# Altium schematic sheet TopLevel.SchDoc
size A4; SheetNumber: 1; SheetTotal: 3
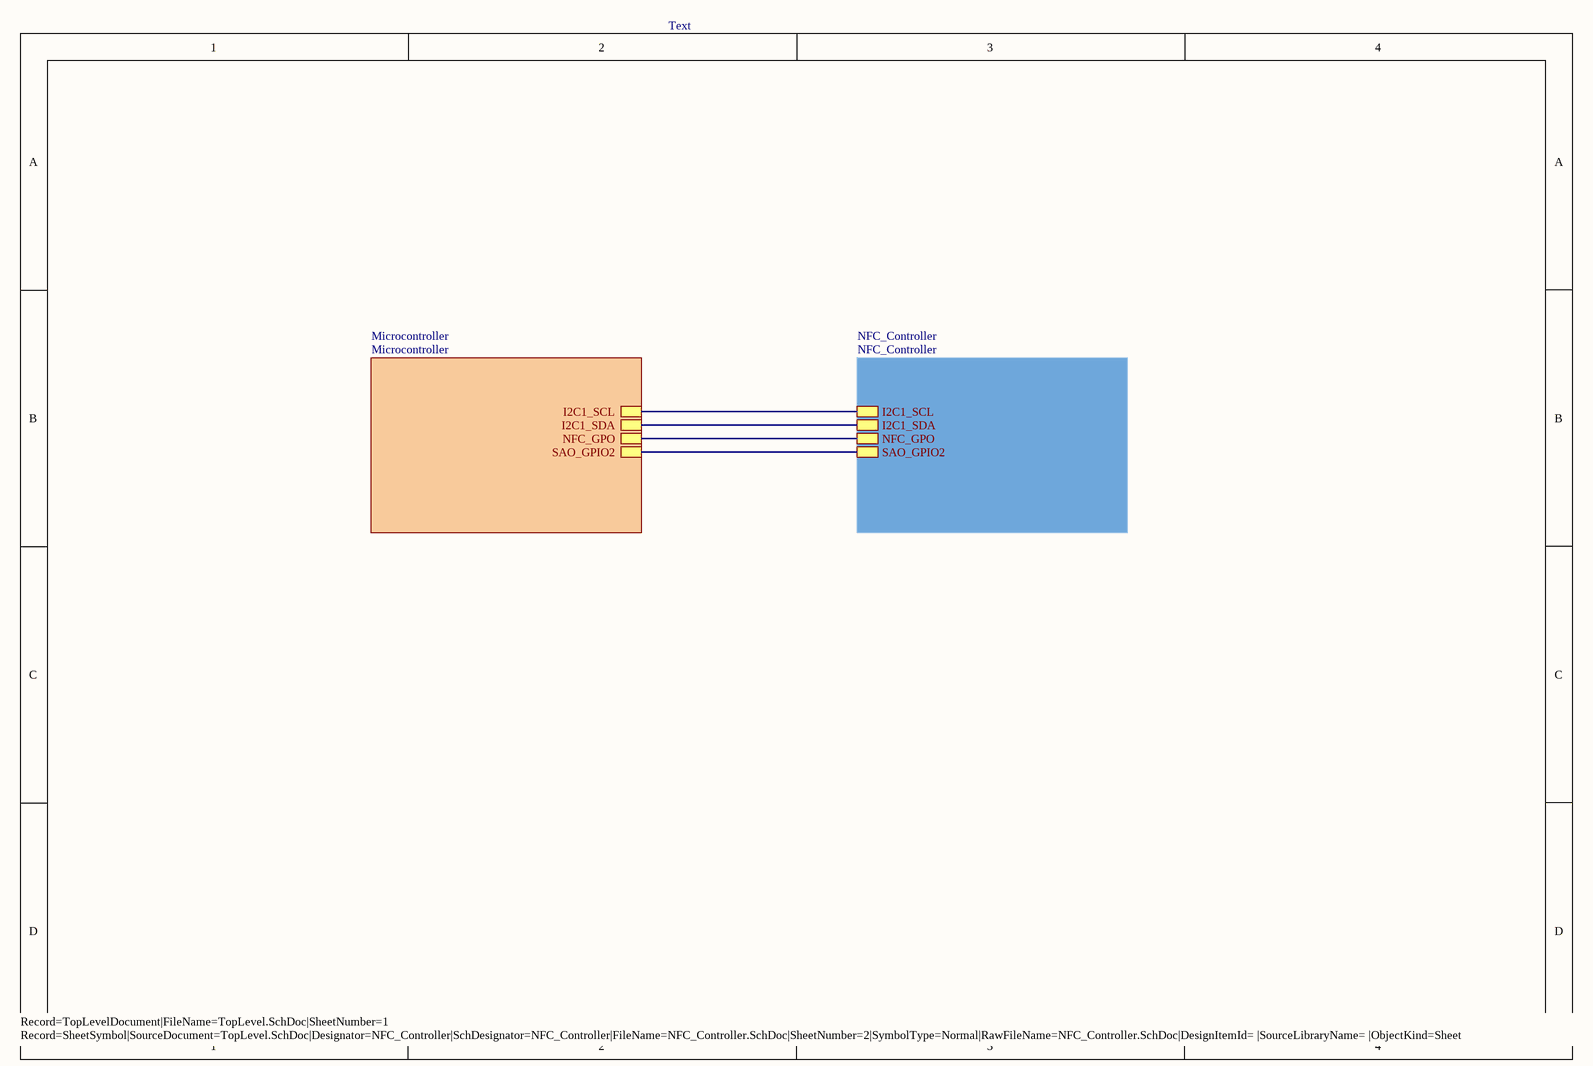
[diagram p0: TopLevel.SchDoc]

## Sub-sheets
Microcontroller = Microcontroller: I2C1_SCL, SAO_GPIO2, I2C1_SDA, NFC_GPO
NFC_Controller = NFC_Controller: I2C1_SCL, I2C1_SDA, NFC_GPO, SAO_GPIO2

## Nets
(unnamed): sheet Microcontroller/I2C1_SCL, sheet NFC_Controller/I2C1_SCL
(unnamed): sheet Microcontroller/SAO_GPIO2, sheet NFC_Controller/SAO_GPIO2
(unnamed): sheet Microcontroller/I2C1_SDA, sheet NFC_Controller/I2C1_SDA
(unnamed): sheet Microcontroller/NFC_GPO, sheet NFC_Controller/NFC_GPO

## Notes on the sheet
- Text
- Record=TopLevelDocument|FileName=TopLevel.SchDoc|SheetNumber=1
  Record=SheetSymbol|SourceDocument=TopLevel.SchDoc|Designator=NFC_Controller|SchDesignator=NFC_Controller|FileName=NFC_Controller.SchDoc|SheetNumber=2|SymbolType=Normal|RawFileName=NFC_Controller.SchDoc|DesignItemId= |SourceLibraryName= |ObjectKind=Sheet Symbol|RevisionGUID= |ItemGUID= |VaultGUID=